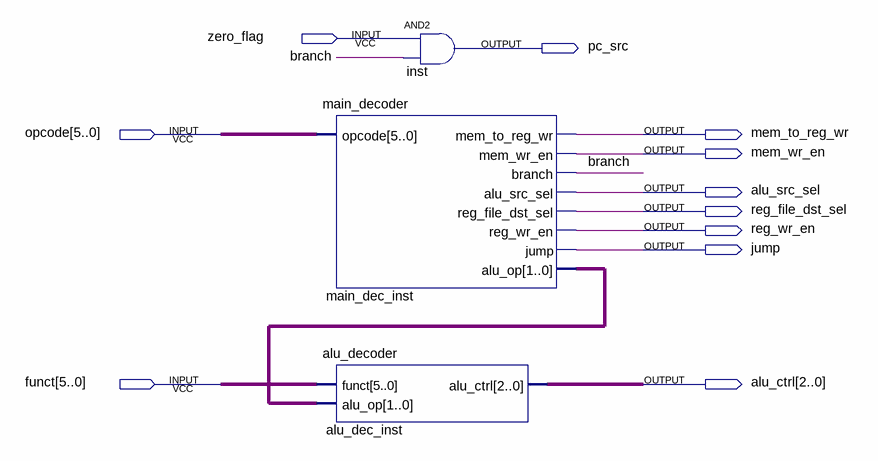
[diagram p0: schematic sheet]
// Quartus schematic controller.bdf as structural Verilog: 3 symbols, 11 pins
module controller (
  input  zero_flag,
  input  [5:0] opcode,
  input  [5:0] funct,
  output pc_src,
  output mem_to_reg_wr,
  output mem_wr_en,
  output alu_src_sel,
  output reg_file_dst_sel,
  output reg_wr_en,
  output jump,
  output [2:0] alu_ctrl
);

  wire branch;
  wire [1:0] main_dec_inst_alu_op;

  main_decoder main_dec_inst (
    .opcode(opcode), .mem_to_reg_wr(mem_to_reg_wr), .mem_wr_en(mem_wr_en), .branch(branch),
    .alu_src_sel(alu_src_sel), .reg_file_dst_sel(reg_file_dst_sel), .reg_wr_en(reg_wr_en), .jump(jump),
    .alu_op(main_dec_inst_alu_op));
  alu_decoder alu_dec_inst (.funct(funct), .alu_op(main_dec_inst_alu_op), .alu_ctrl(alu_ctrl));
  and inst (pc_src, zero_flag, branch);
endmodule
